# EAGLE design Domino JTAG No Teardrop (EAGLE 6.5.0)
DATABASE: ./../Common/BOM/Domino_DB.txt; DRAWN: M.STEMPIN; REV: A
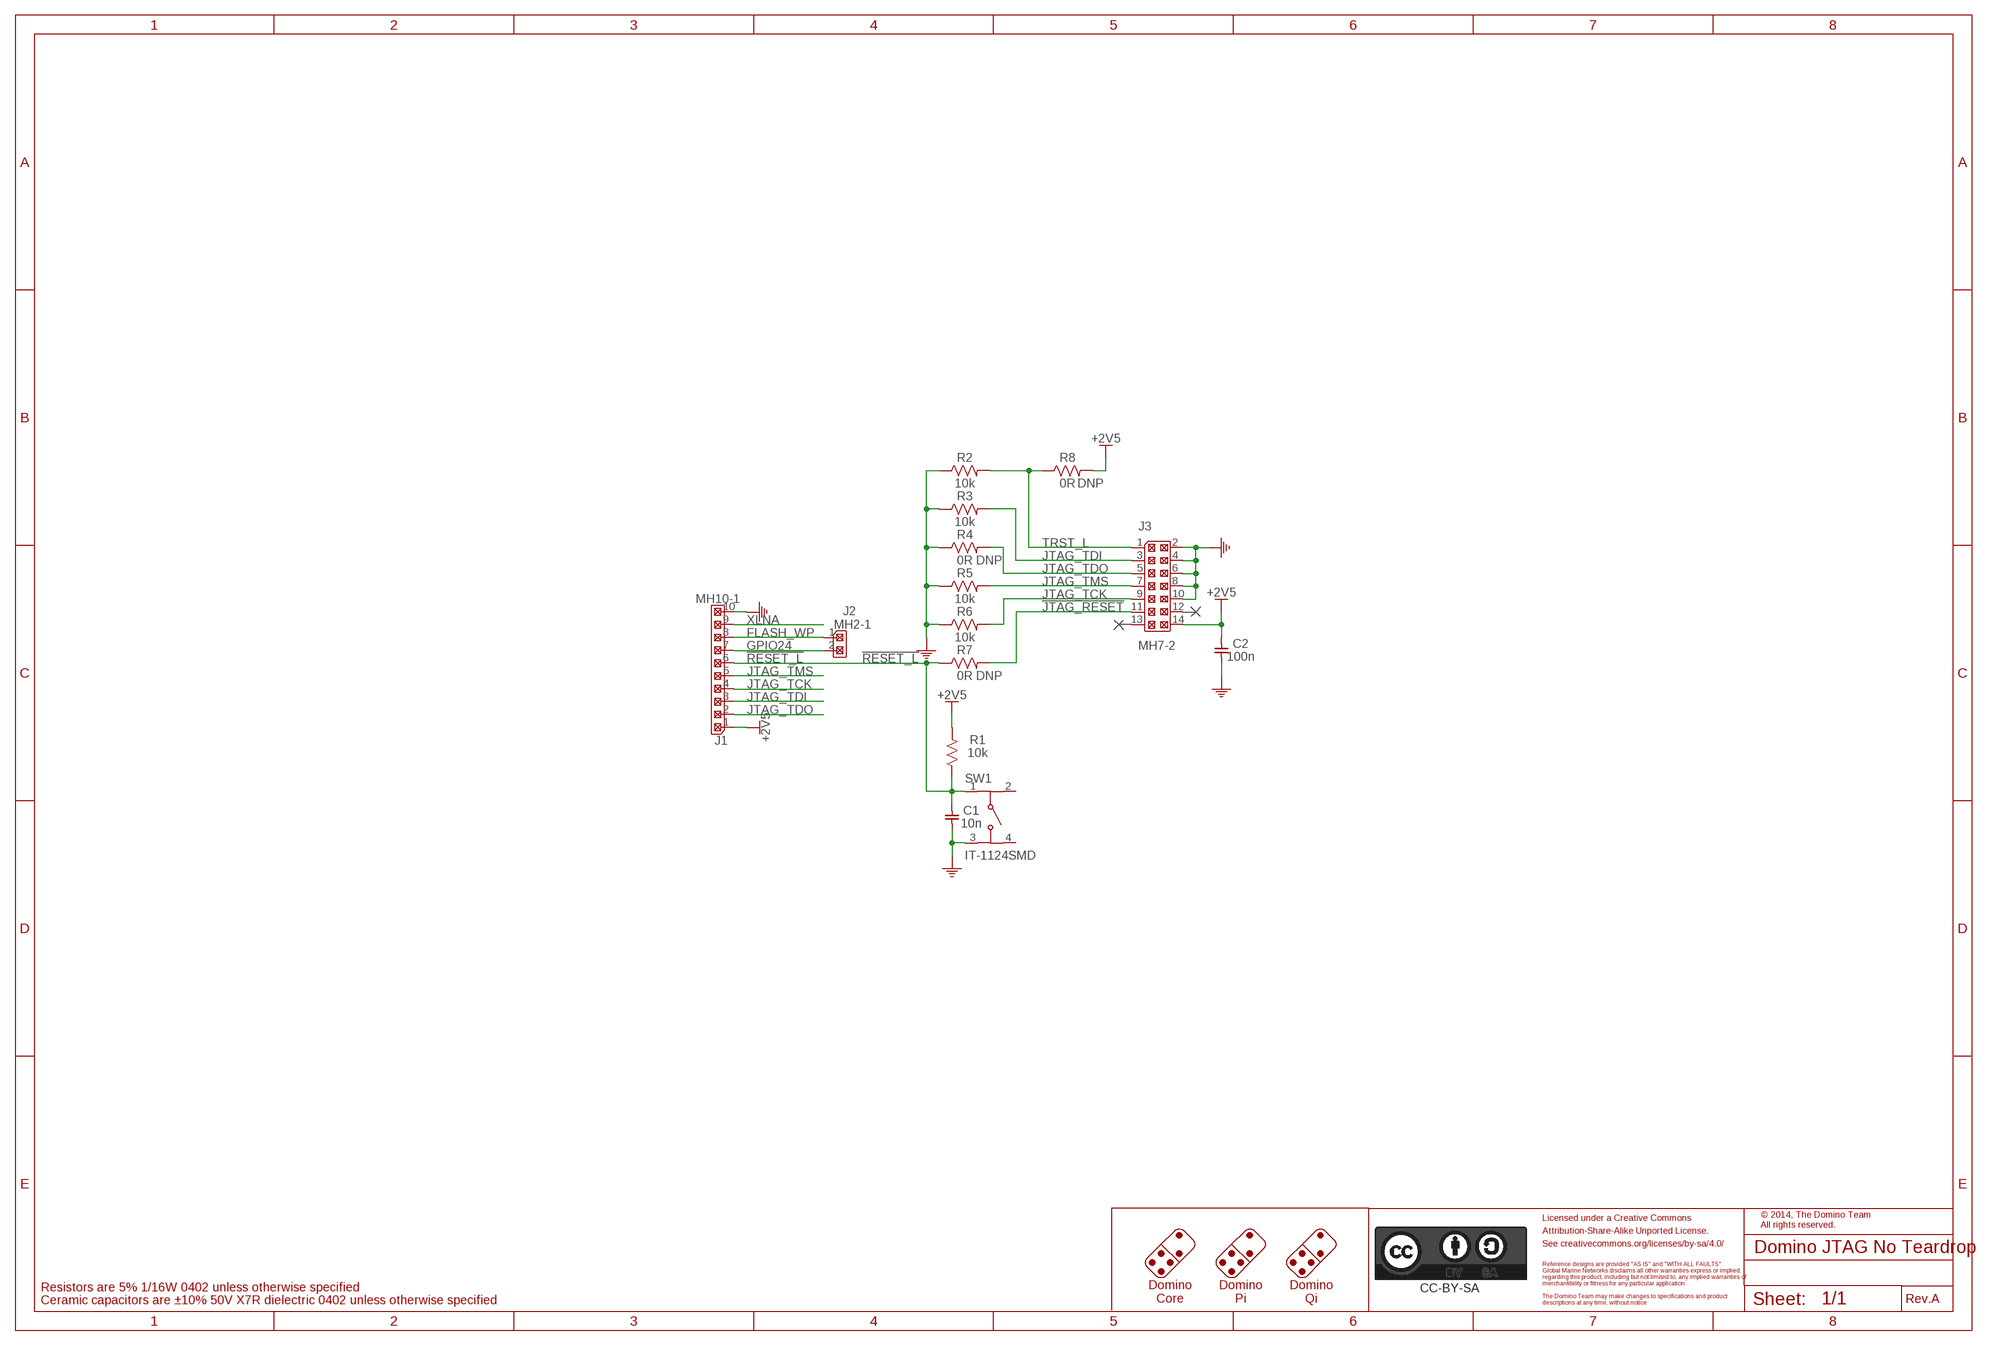
[diagram p0: schematic, sheet 1]
PORT1 (NC): BOM: EXCLUDE
PORT2 (NC): BOM: EXCLUDE

## Parts
C1  10n  CAP_0402  [C0402]
C2  100n  CAP_0402  [C0402]
CC-BY-SA1  CC-BY-SA_LOGO  [CC-BY-SA_LOGO]
J1  MH10-1  [MH10-1-0.1]
J2  MH2-1  [MH2-1-0.1]
J3  MH7-2  [MH7-2-0.1]
R1  10k  RES_0402  [R0402]
R2  10k  RES_0402  [R0402]
R3  10k  RES_0402  [R0402]
R4  0R  RES_0603  [R0603]
R5  10k  RES_0402  [R0402]
R6  10k  RES_0402  [R0402]
R7  0R  RES_0603  [R0603]
R8  0R  RES_0603  [R0603]
SW1  IT-1124SMD  [IT-1124SMD]

## Nets
!JTAG_RESET: J3.11 R7.2
!RESET_L: C1.1 J1.6 R1.1 R7.1 SW1.1
+2V5: C2.1 J1.1 J3.14 R1.2 R8.2
FLASH_WP: J1.8 J2.1
GND: C1.2 C2.2 J1.10 J3.2 J3.4 J3.6 J3.8 J3.10 R2.1 R3.1 R4.1 R5.1 R6.1 SW1.3
GPIO24: J1.7 J2.2
JTAG_TCK: J1.4 J3.9 R6.2
JTAG_TDI: J1.3 J3.3 R3.2
JTAG_TDO: J1.2 J3.5 R4.2
JTAG_TMS: J1.5 J3.7 R5.2
TRST_L: J3.1 R2.2 R8.1
XLNA: J1.9
Unconnected: J3.12 J3.13 SW1.2 SW1.4

## Notes on the sheet
- Licensed under a Creative Commons
- © 2014, The Domino Team
  All rights reserved.
- Attribution-Share-Alike Unported License.
- See creativecommons.org/licenses/by-sa/4.0/
- Reference designs are provided "AS IS" and "WITH ALL FAULTS".
- Global Marine Networks disclaims all other warranties express or implied,
- regarding this product, including but not limited to, any implied warranties of
- merchantibility or fitness for any particular application.
- Resistors are 5% 1/16W 0402 unless otherwise specified
- Domino
  Core
- Domino
  Pi
- Domino
  Qi
- The Domino Team may make changes to specifications and product
- Ceramic capacitors are ±10% 50V X7R dielectric 0402 unless otherwise specified | descriptions at any time, without notice. | Rev.

## Library data of the parts
C1 = Domino:CAP_: Capacitor; PARTNO: C0402_10n_X7R_10%_CER_50V; SIZE: 0402; TC: X7R; TOL: ±10%; TYPE: CER; VOLT: 50V
C2 = Domino:CAP_: Capacitor; PARTNO: C0402_100n_X7R_10%_CER_50V; SIZE: 0402; TC: X7R; TOL: ±10%; TYPE: CER; VOLT: 50V
CC-BY-SA1 = Domino:CC-BY-SA_LOGO: Attribution-Share-Alike Unported License See creativecommons.org/licenses/by-sa/3.0/ for details.; BOM: EXCLUDE
J1 = Domino:MH10-1: 10x1 Pin Male Header; PARTNO: MH10-1-0.1
J2 = Domino:MH2-1: 2x1 Pin Male Header; PARTNO: MH2-1-0.1
J3 = Domino:MH7-2: 2x7 Pin Male Header; PARTNO: MH7-2-0.1
R1-R3 R5 R6 = Domino:RES_: Resistor; PARTNO: R0402_10k_5%_62.5mW; RATE: 62.5mW; SIZE: 0402; TOL: 5%
R4 R7 R8 = Domino:RES_: Resistor; DNP: T; PARTNO: R0603_0R_5%_125mW; RATE: 125mW; SIZE: 0603; TOL: 5%
SW1 = Domino:IT-1124SMD: SPST Tact Switch; PARTNO: IT-1124SMD

## Net classes
1 USB: width 0.254 mm, clearance 0.127 mm
2 PoE: width 0.61 mm, clearance 0.13 mm to class 0, clearance 0.13 mm to class 1, clearance 0.13 mm

## Board
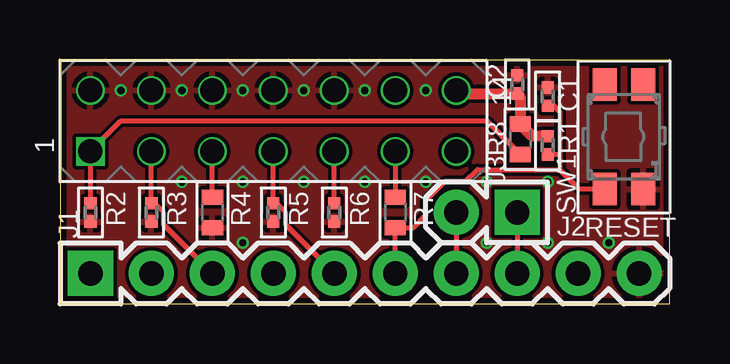
[diagram p1: board, top side]
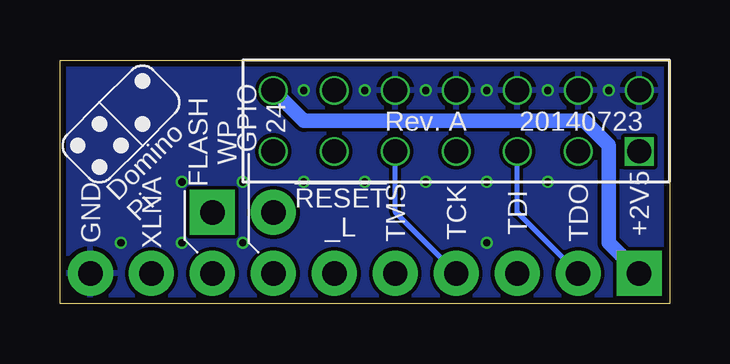
[diagram p2: board, bottom side, seen from below]

Size 25.4 x 10.16 mm. Coordinates in mm from the lower left corner, seen from the top.
Outline: 0,0 25.4,0 25.4,10.16 0,10.16 0,0
Copper layers (1*16): Top 0.043mm / dielectric 1mm / Bottom 0.043mm
Design rules "Domino": minimum track width 0.1mm, minimum drill 0.3mm, track to track 6mil, track to pad 6mil, pad to pad 6mil, via to via 6mil, smd to smd 0mil, copper to edge 0.25mm, drill to drill 0.35mm, minimum pad ring 0.085mm, minimum via ring 0.1mm, stop-mask expansion 0mil, vias tented up to drill 0.45mm, thermal gap 0.2mm

### Footprints (pad centres in the part's own frame; a part is rotated, then mirrored left to right if it is on the bottom)
C0402 = smd 0.508 x 0.508: 1 -0.381,0; 2 0.381,0
MH10-1-0.1 = drill 1.016 pad 1.88 square: 1 0,0 | drill 1.016 pad 1.88: 2 2.54,0; 3 5.08,0; 4 7.62,0; 5 10.16,0; 6 12.7,0; 7 15.24,0; 8 17.78,0; 9 20.32,0; 10 22.86,0
MH2-1-0.1 = drill 1.016 pad 1.88 square: 1 0,0 | drill 1.016 pad 1.88: 2 2.54,0
MH7-2-0.1 = drill 1 square: 1 -1.27,7.62 | drill 1: 2 1.27,7.62; 3 -1.27,5.08; 4 1.27,5.08; 5 -1.27,2.54; 6 1.27,2.54; 7 -1.27,0; 8 1.27,0; 9 -1.27,-2.54; 10 1.27,-2.54; 11 -1.27,-5.08; 12 1.27,-5.08; 13 -1.27,-7.62; 14 1.27,-7.62
R0402 = smd 0.508 x 0.508: 1 -0.381,0; 2 0.381,0
R0603 = smd 0.635 x 0.889: 1 -0.635,0; 2 0.635,0
IT-1124SMD = smd 1.35 x 1: 1 -2.175,0.8; 2 2.175,0.8; 3 -2.175,-0.8; 4 2.175,-0.8

### Placement (x,y rotation side)
C1  20.32,8.64 90 top
C2  19.05,9.14 90 top
CC-BY-SA1  -5.08,-50.8 0 top  (outside the outline)
DRILEGEND  [DRILEGEND]  81.53,59.94 0 top  (outside the outline)
J1  1.27,1.27 0 top
J2  19.05,3.81 180 top
J3  8.89,7.62 90 top
R1  20.32,6.6 90 top
R2  1.27,3.81 90 top
R3  3.81,3.81 90 top
R4  6.35,3.81 90 top
R5  8.89,3.81 90 top
R6  11.43,3.81 90 top
R7  13.97,3.81 90 top
R8  19.18,6.86 90 top
SW1  23.5,6.96 90 top
U$3  [A5L-LOC]  -55.88,-62.23 0 top  (outside the outline)
U$4  [DOMINO_LOGO_SMALL]  22.86,7.49 0 bottom

### Tracks (layer width: path | path; a pad name or v marks a point on that pad's centre or on a via)
!JTAG_RESET
  Top 0.203: J3.11 R7.2
!RESET_L
  Top 0.203: SW1.1 21.63,4.79 20.83,5.59 | 20.83,5.59 17.4,5.59 16.89,5.08 16,5.08 15.24,4.32 15.24,3.68 14.73,3.17 R7.1 J1.6 | C1.1 20.57,8.26 20.83,8 20.83,6.22 | 20.83,6.22 20.83,5.59 | R1.1 20.83,6.22
+2V5
  Top 0.457: 16.64,8.76 C2.1 19.18,8.64 R8.2 19.68,6.99 R1.2
  Top 0.61: J3.14 16.64,8.76
  Bottom 0.61: J3.14 15.24,7.62 3.56,7.62 2.54,6.6 2.54,2.54 J1.1
FLASH_WP
  Top 0.203: J2.1 J1.8
GND  (via drill 0.3 pad 0.03)
  other vias: 10.16,5.08 5.08,5.08 7.62,2.54 17.78,2.54 17.78,5.08 20.32,2.54 15.24,5.08 7.62,5.08 20.32,5.08 22.86,2.54 15.24,8.89 12.7,5.08 12.7,8.89 10.16,8.89 7.62,8.89 5.08,8.89 2.54,8.89
  pour Top: 0,10.16 25.4,10.16 25.4,0 0,0
  pour Bottom: 0,10.16 25.4,10.16 25.4,0 0,0
GPIO24
  Top 0.203: J2.2 J1.7
JTAG_TCK
  Top 0.203: R6.2 J3.9
  Bottom 0.203: J3.9 11.43,3.81 J1.4
JTAG_TDI
  Top 0.203: J3.3 R3.2 3.94,4.19 4.32,3.81 4.32,3.3 J1.3
JTAG_TDO
  Top 0.203: R4.2 J3.5
  Bottom 0.203: J3.5 6.35,3.81 J1.2
JTAG_TMS
  Top 0.203: J3.7 R5.2 9.02,4.19 9.4,3.81 9.4,3.3 J1.5
TRST_L
  Top 0.203: R2.2 J3.1 2.54,7.62 17.78,7.62 R8.1

### Text on the board
tPlace: RESET
bPlace: GPIO / 24 | FLASH / WP | +2V5 | TDO | TDI | TCK | TMS | !RESET / _L | XLNA | GND
bNames: Rev. A
Document: DRILL CHART: TOP TO BOTTOM | STACK-UP FOR REFERENCE | LAYER 1 L1 TOP | 18 UM CU + 12.5 UM PLATING (30.5 UM) | 1.061 MM+/-10% | CORE | 1.0 MM CORE FR-4 LG 135 / INCLUDING COPPER | LAYER 4 L16 BOTTOM | 18 UM CU + 12.5 UM PLATING (30.5 UM) | NOTES: | 1. PRINTED CIRCUIT BOARD MADE FROM NEMA GRADE FR-4 TG 135 EPOXY / LAMINATE WITH 18 UM COPPER PLATING AND 1 MM THICKNESS. | 2. ALL DIMENSIONS ARE GIVEN IN MILLIMETERS EXCEPT TRACE WIDTH/SPACE. | 3. CIRCUIT PATHS ARE FOR REFERENCE ONLY. | 4. HOLE SIZES SHOWN ARE FINISHED DIAMETERS AFTER PLATING. | 5. BOARD PLATED USING REFLOW OR SIMILAR METHOD. | 6. BOARD TO HAVE WHITE SOLDER MASK ON PLATED SURFACES USING WET / FILM SR100 OR SR1010 EPOXY. / EQUIVALENT WET OR DRY FILM MAY BE USED. | 7. SILKSCREEN BOARD USING BLACK INK. DISTORTION OF SILKSCREEN / IS ACCEPTABLE OVER TRACES. EPOXY INK ON PLATED LANDS IS NOT / ACCEPTABLE | 8. THE FOLLOWING INFORMATION APPLIES TO THIS BOARD: | * 2 COPPER LAYERS | * 1 MM BOARD THICKNESS | * REQUIRES TOP AND BOTTOM SIDE SILKSCREENS | © 2014, The Domino Team. / All rights reserved. | Licensed under a Creative Commons / Attribution-Share-Alike Unported License. / See creativecommons.org/licenses/by-sa/4.0/ | Reference designs are provided "AS IS" and "WITH ALL FAULTS". / The Domino Team disclaims all other warranties express or implied, / regarding this product, including but not limited to, any implied warranties of / merchantibility or fitness for any particular application. | Domino / Core | Domino / Pi | Domino / Qi | The Domino Team may make changes to specifications and product descriptions / at any time, without notice. | Rev.
DrillLegend: LAYER-STACK
DrillLegend_01-16: 01-16
Pinout: GND | GND | GND | GND | GND | NC | +2V5 | !TRST_L | JTAG_TDI | JTAG_TDO | JTAG_TMS | JTAG_TCK | !JTAG_RESET | NC | GPIO24 | FLASH_WP | +2V5 | JTAG_TDO | JTAG_TDI | JTAG_TCK | JTAG_TMS | !RESET_L | GPIO24 | FLASH_WP | XLNA | GND | Pinout (.PIN)
Component_side: Component Side (.CMP)
Solder_side: Solder side (.SOL)
Silk_screen_CMP: Silk screen CMP (.PLC)
Silk_screen_SOL: Silk screen SOL (.PLS)
Solder_stop_mask_CMP: Solder stop mask CMP (.STC)
Solder_stop_mask_SOL: Solder stop mask SOL (.STS)
Cream_frame_CMP: Cream frame CMP (.CRC)
Cream_frame_SOL: Cream frame SOL (.CRS)
Drill_data: Drill data (.DRD)
Component_Assembly_CMP: Component Assembly CMP (.ASC)
Component_Assembly_SOL: Component Assembly SOL (.ASS)
Outline: Outline (.OLN)